# EAGLE design TemperatureSensor (EAGLE 7.1.0)
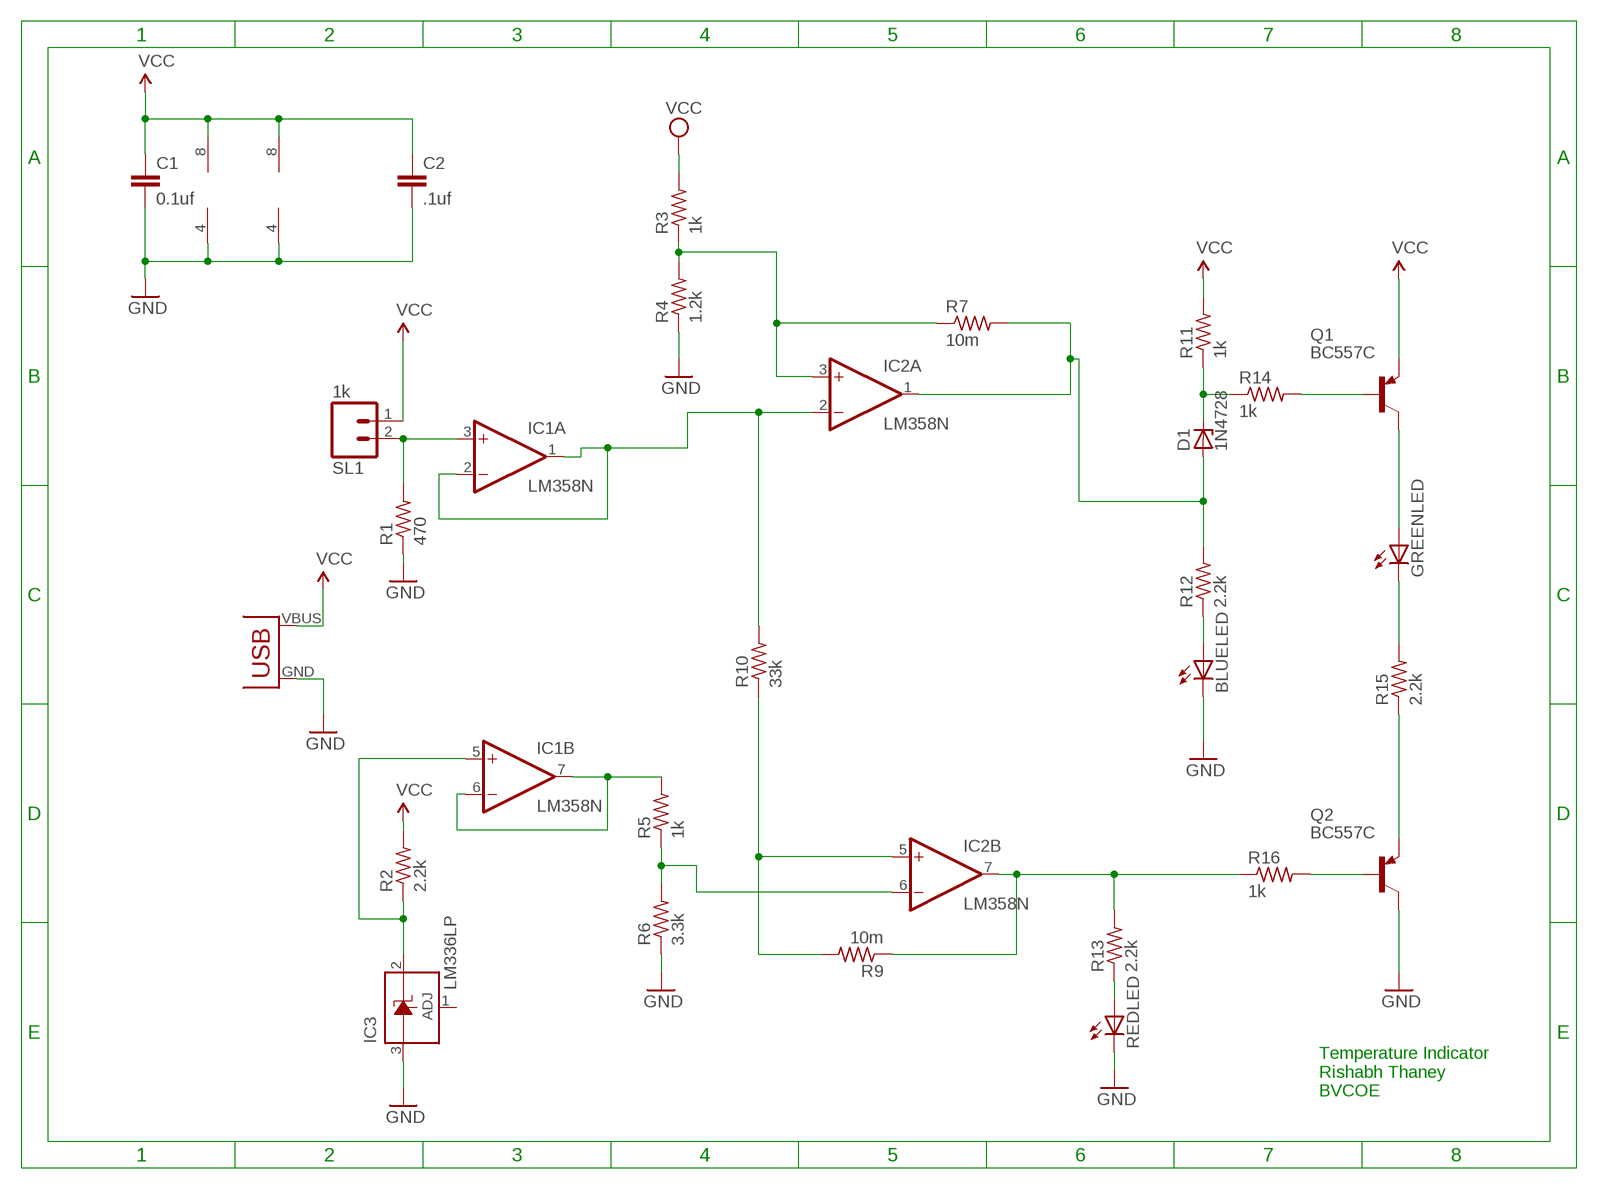
[diagram p0: schematic, sheet 1]

## Parts
BLUELED  LED5MM  [LED5MM]
C1  0.1uf  C-EU025-024X044  [C025-024X044]
C2  .1uf  C-EU025-024X044  [C025-024X044]
D1  1N4728  [DO41Z10]
GREENLED  LED5MM  [LED5MM]
IC1  LM358N  [DIL08]
IC2  LM358N  [DIL08]
IC3  LM336LP  [TO92]
Q1  BC557C  [TO92-EBC]
Q2  BC557C  [TO92-EBC]
R1  470  R-US_0204/7  [0204/7]
R2  2.2k  R-US_0204/7  [0204/7]
R3  1k  R-US_0204/7  [0204/7]
R4  1.2k  R-US_0204/7  [0204/7]
R5  1k  R-US_0204/7  [0204/7]
R6  3.3k  R-US_0204/7  [0204/7]
R7  10m  R-US_0204/7  [0204/7]
R9  10m  R-US_0204/7  [0204/7]
R10  33k  R-US_0204/7  [0204/7]
R11  1k  R-US_0204/7  [0204/7]
R12  2.2k  R-US_0204/7  [0204/7]
R13  2.2k  R-US_0204/7  [0204/7]
R14  1k  R-US_0204/7  [0204/7]
R15  2.2k  R-US_0204/7  [0204/7]
R16  1k  R-US_0204/7  [0204/7]
REDLED  LED5MM  [LED5MM]
SL1  1k  M02  [02P]
U$1  USB(POWER)  [USB(POWER)]

## Nets
GND: BLUELED.K(C) C1.2 C2.2 IC1.4(P:V-) IC2.4(P:V-) IC3.3(A) Q2.C R1.1 R4.1 R6.1 REDLED.K(C) U$1.GND
N$1: IC1.3(A:+IN) R1.2 SL1.2
N$2: R13.1 REDLED.A
N$3: IC2.3(A:+IN) R3.1 R4.2 R7.1
N$4: BLUELED.A R12.1
N$5: D1.C R11.1 R14.1
N$6: D1.A IC2.1(A:OUT) R7.2 R12.2
N$7: Q1.B R14.2
N$8: GREENLED.A Q1.C
N$9: GREENLED.K(C) R15.2
N$10: Q2.E R15.1
N$11: Q2.B R16.2
N$12: IC2.7(B:OUT) R9.1 R13.2 R16.1
N$15: IC1.6(B:-IN) IC1.7(B:OUT) R5.2
N$16: IC2.6(B:-IN) R5.1 R6.2
N$18: IC1.5(B:+IN) IC3.2(C) R2.1
N$19: IC1.1(A:OUT) IC1.2(A:-IN) IC2.2(A:-IN) R10.2
N$21: IC2.5(B:+IN) R9.2 R10.1
VCC: C1.1 C2.1 IC1.8(P:V+) IC2.8(P:V+) Q1.E R2.2 R3.2 R11.2 SL1.1 U$1.VBUS(VCC)
Unconnected: IC3.1(ADJ)

## Notes on the sheet
- Temperature Indicator
  Rishabh Thaney
  BVCOE

## Library data of the parts
BLUELED GREENLED REDLED = CEDT_JANUARY_2015_v7:LED
C1 C2 = rcl:C-EU: CAPACITOR, European symbol
D1 = diode:1N4728: Z DIODE 3.3 V, 1W, 5 percent
IC1 IC2 = CEDT_JANUARY_2015_v7:LM358: OP AMP also LM158; LM258; LM2904 Source: http://cache.national.com/ds/LM/LM158.pdf
IC3 = linear:LM336: 2.5-V INTEGRATED REFERENCE CIRCUITS LM236 Source: http://focus.ti.com/lit/ds/symlink/lm336-2.5.pdf
Q1 Q2 = transistor-pnp:BC557*: PNP Transistror
R1-R7 R9-R16 = rcl:R-US_: RESISTOR, American symbol
SL1 = CEDT_JANUARY_2015_v7:M02: AMP QUICK CONNECTOR
U$1 = CEDT_JANUARY_2015_v7:USB(POWER)

## Board
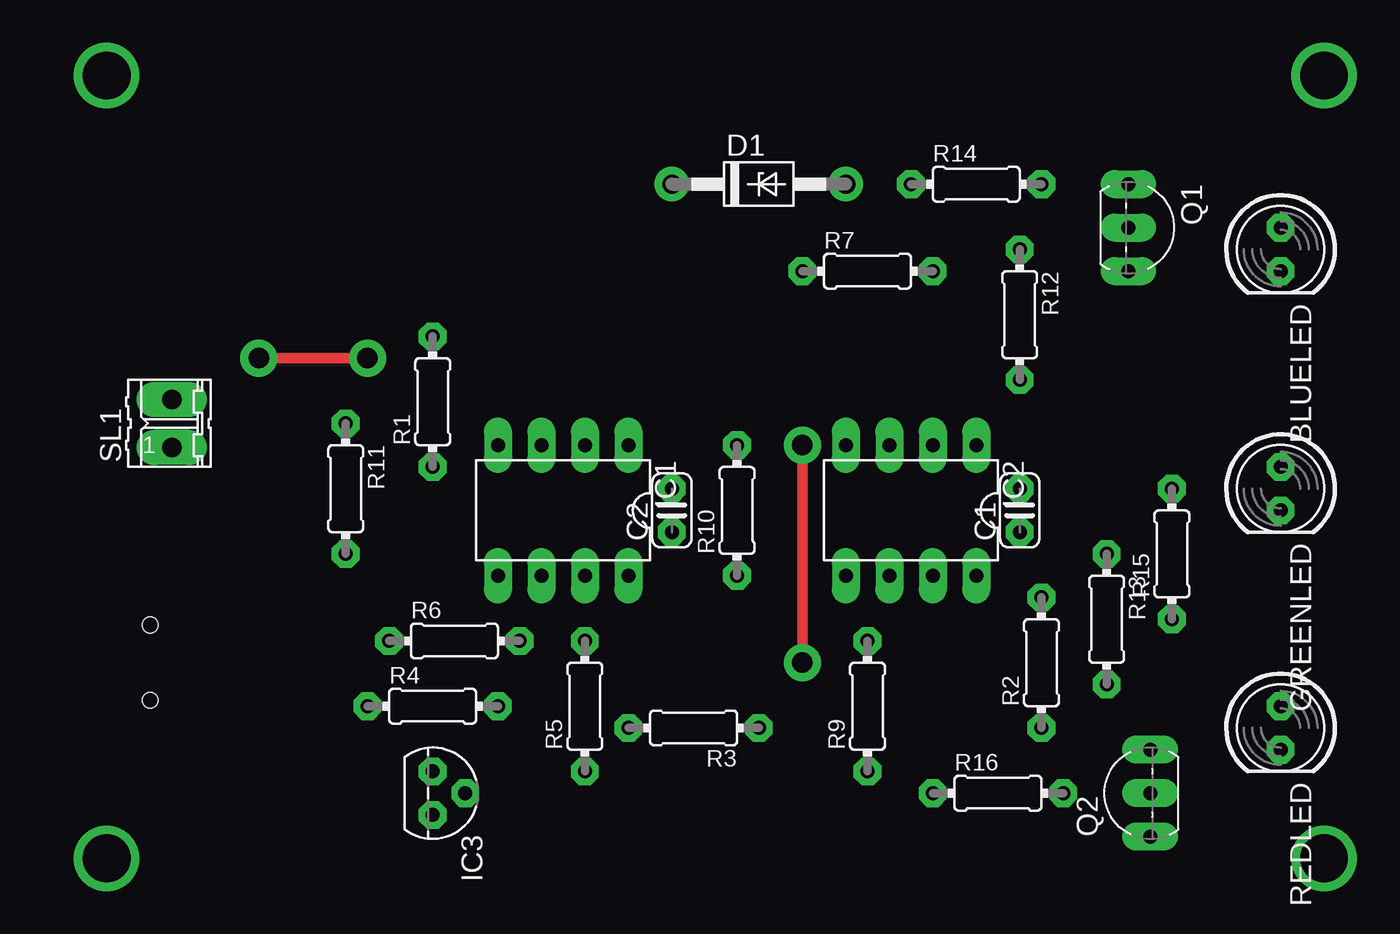
[diagram p1: board, top side]
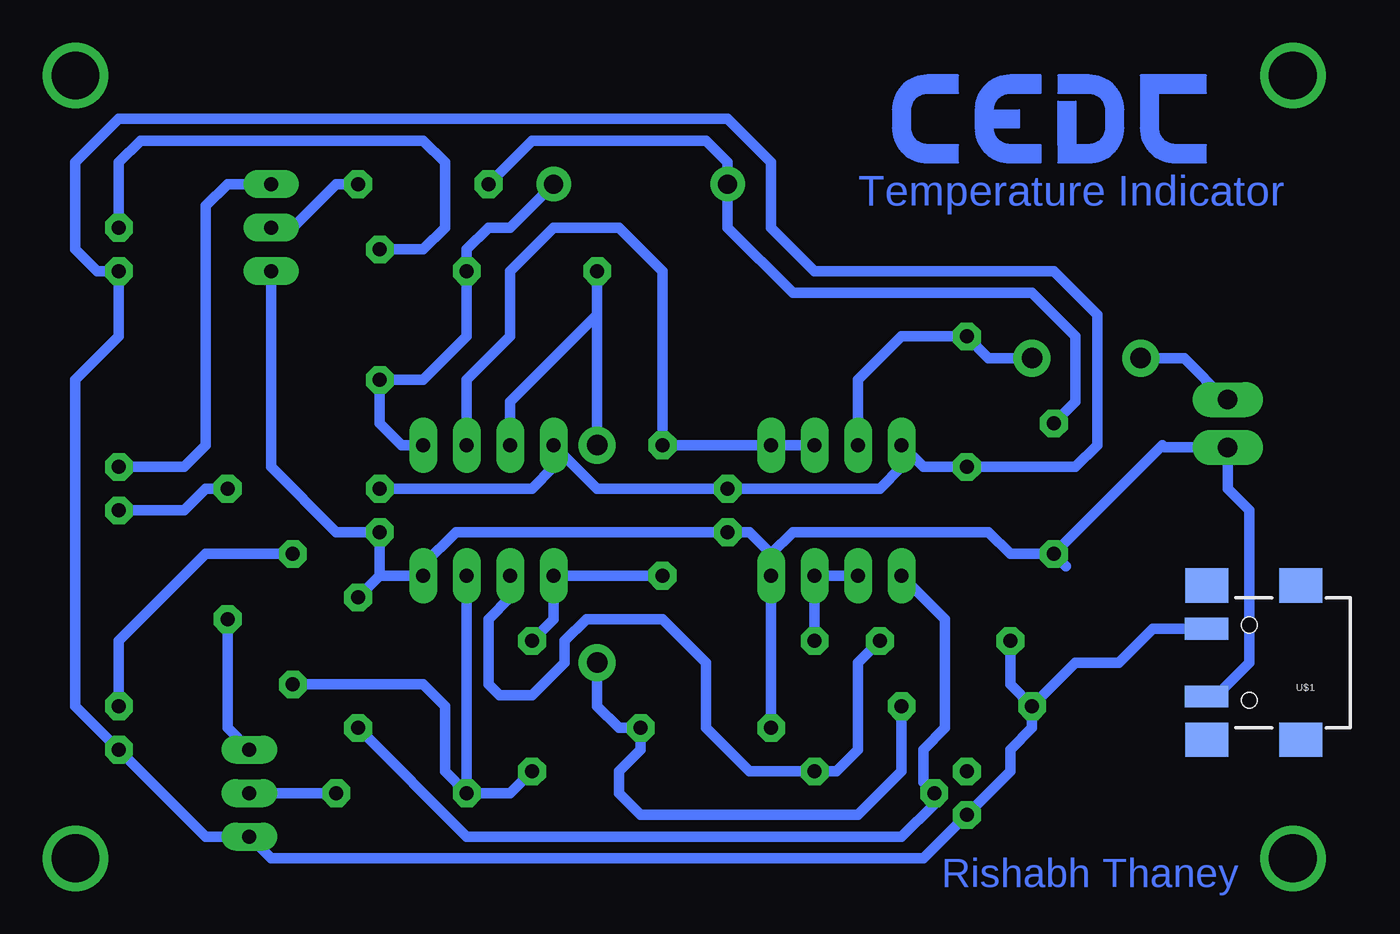
[diagram p2: board, bottom side, seen from below]

No outline drawn. Coordinates in mm, seen from the top.
Copper layers (1*16): Top 0.035mm / dielectric 1.5mm / Bottom 0.035mm
Design rules "default *": minimum track width 10mil, minimum drill 24mil, track to track 12mil, track to pad 12mil, pad to pad 8mil, via to via 8mil, smd to smd 8mil, copper to edge 40mil, drill to drill 8mil, minimum pad ring 16mil, minimum via ring 8mil, stop-mask expansion 4mil, vias tented up to drill 0mil, thermal gap 10mil

### Footprints (pad centres in the part's own frame; a part is rotated, then mirrored left to right if it is on the bottom)
LED5MM = drill 0.813 octagon: A -1.27,0; K 1.27,0
C025-024X044 = drill 0.813 octagon: 1 -1.27,0; 2 1.27,0
DO41Z10 = drill 1.118: A 5.08,0; C -5.08,0
DIL08 = drill 0.813 long: 1 -3.81,-3.81; 2 -1.27,-3.81; 3 1.27,-3.81; 4 3.81,-3.81; 5 3.81,3.81; 6 1.27,3.81; 7 -1.27,3.81; 8 -3.81,3.81
TO92 = drill 0.813 octagon: 1 -1.27,0; 2 0,1.905; 3 1.27,0
TO92-EBC = drill 0.813 long: B 0,-1.27; C -2.54,-1.27; E 2.54,-1.27
0204/7 = drill 0.813 octagon: 1 -3.81,0; 2 3.81,0
02P = drill 1.143 long: 1 -1.397,0; 2 1.397,0
USB(POWER) = smd 2.54 x 1.27: GND 2.5,-1.981; VBUS 2.5,1.981 | smd 2.5 x 2: GND@1 -3,-4.5; GND@2 -3,4.5; GND@3 2.5,4.5; GND@4 2.5,-4.5 | hole 0.9: 0,2.2; 0,-2.2

### Placement (x,y rotation side)
BLUELED  71.12,38.1 270 top
C1  55.88,22.86 90 top
C2  35.56,22.86 90 top
D1  40.64,41.91 0 top
GREENLED  71.12,24.13 270 top
IC1  29.21,22.86 180 top
IC2  49.53,22.86 180 top
IC3  21.59,6.35 270 top
Q1  63.5,39.37 270 top
Q2  62.23,6.35 90 top
R1  21.59,29.21 90 top
R2  57.15,13.97 90 top
R3  36.83,10.16 180 top
R4  21.59,11.43 0 top
R5  30.48,11.43 90 top
R6  22.86,15.24 0 top
R7  46.99,36.83 0 top
R9  46.99,11.43 90 top
R10  39.37,22.86 90 top
R11  16.51,24.13 270 top
R12  55.88,34.29 270 top
R13  60.96,16.51 270 top
R14  53.34,41.91 0 top
R15  64.77,20.32 90 top
R16  54.61,6.35 0 top
REDLED  71.12,10.16 270 top
SL1  6.35,27.94 90 top
U$1  5.08,13.97 180 bottom
U$2  [LOGO-CEDT-BOT-18MM]  7.62,43.18 0 top

### Tracks (layer width: path | path; a pad name or v marks a point on that pad's centre or on a via)
GND
  Bottom 0.61: R4.1 19.05,12.7 R6.1 | 25.4,27.94 IC1.4 | IC1.4 24.13,25.4 R1.1 15.24,25.4 13.97,26.67 13.97,34.29 16.51,36.83 30.48,36.83 33.02,39.37 33.02,43.18 35.56,45.72 71.12,45.72 73.66,43.18 73.66,38.1 72.39,36.83 BLUELED.K 71.12,33.02 73.66,30.48 73.66,11.43 REDLED.K 66.04,3.81 Q2.C 62.23,2.54 24.13,2.54 IC3.3 19.05,7.62 19.05,8.89 17.78,10.16 R4.1 | C1.2 46.99,24.13 45.72,25.4 IC2.4 43.18,24.13 C2.2 26.67,24.13 25.4,25.4 IC1.4 | U$1.GND 10.72,15.95 12.7,13.97 15.24,13.97 R4.1
N$1  (via drill 1.2 pad 1.93)
  Top 0.61: v17.78,31.75 v11.43,31.75
  Bottom 0.61: v17.78,31.75 20.32,31.75 R1.2 25.4,33.02 27.94,30.48 IC1.3 | SL1.2 6.48,29.34 8.89,31.75 v11.43,31.75
N$2
  Bottom 0.61: REDLED.A 71.12,15.24 66.04,20.32 R13.1
N$3  (via drill 1.2 pad 1.93)
  Top 0.61: v43.18,13.97 v43.18,26.67
  Bottom 0.61: R4.2 25.4,7.62 27.94,5.08 40.64,5.08 41.91,6.35 41.91,7.62 40.64,8.89 R3.1 41.91,10.16 43.18,11.43 v43.18,13.97 | R7.1 43.18,34.29 | 43.18,34.29 48.26,29.21 IC2.3 | v43.18,26.67 43.18,34.29
N$4
  Bottom 0.61: BLUELED.A 71.12,43.18 69.85,44.45 53.34,44.45 52.07,43.18 52.07,39.37 53.34,38.1 R12.1
N$5
  Bottom 0.61: R14.1 46.99,44.45 36.83,44.45 35.56,43.18 D1.C 35.56,39.37 31.75,35.56 17.78,35.56 15.24,33.02 15.24,29.21 R11.1
N$6
  Bottom 0.61: IC2.1 54.61,26.67 55.88,27.94 R12.2 53.34,30.48 50.8,33.02 R7.2 50.8,38.1 49.53,39.37 48.26,39.37 D1.A
N$7
  Bottom 0.61: R14.2 58.42,41.91 60.96,39.37 Q1.B
N$8
  Bottom 0.61: GREENLED.A 67.31,25.4 66.04,26.67 66.04,40.64 64.77,41.91 Q1.C
N$9
  Bottom 0.61: R15.2 66.04,24.13 67.31,22.86 GREENLED.K
N$10
  Bottom 0.61: R15.1 64.77,10.16 Q2.E
N$11
  Bottom 0.61: R16.2 Q2.B
N$12
  Bottom 0.61: IC2.7 R16.1 | R9.1 48.26,6.35 R16.1 | R16.1 52.07,7.62 52.07,11.43 53.34,12.7 R13.2
N$13  (via drill 2.79 pad 3.81)
  other vias: 2.54,48.26
N$14  (via drill 2.79 pad 3.81)
  other vias: 2.54,2.54
N$15
  Bottom 0.61: IC1.6 IC1.7 R5.2
N$16
  Bottom 0.61: IC2.6 48.26,17.78 49.53,16.51 49.53,12.7 48.9,12.06 46.99,12.06 45.09,13.97 45.09,15.24 43.81,16.51 39.37,16.51 36.83,13.97 36.83,10.16 34.29,7.62 R5.1 29.21,7.62 27.94,8.89 27.94,13.97 R6.2
N$17  (via drill 2.79 pad 3.81)
  other vias: 73.66,2.54
N$18
  Bottom 0.61: IC1.5 22.86,16.51 22.86,10.16 24.13,8.89 24.13,6.99 IC3.2 23.5,5.71 25.4,3.81 50.8,3.81 R2.1
N$19
  Bottom 0.61: IC1.2 IC1.1 | IC2.2 50.8,30.48 48.26,33.02 48.26,36.83 45.72,39.37 41.91,39.37 39.37,36.83 R10.2 IC1.1 | IC1.1 33.02,27.94
N$20  (via drill 2.79 pad 3.81)
  other vias: 73.66,48.26
N$21
  Bottom 0.61: R9.2 45.72,16.51 IC2.5 R10.1
VCC
  Bottom 0.61: 33.02,20.32 31.75,21.59 20.32,21.59 19.05,20.32 R11.2 | 33.02,20.32 IC1.8 R3.2 | 33.02,20.32 34.29,21.59 C2.1 51.44,21.59 53.34,19.68 IC2.8 55.88,19.05 | 55.88,19.05 R2.2 | Q1.E 62.23,25.4 58.42,21.59 C1.1 55.88,19.05 | R11.2 10.16,26.67 10.03,26.54 SL1.1 6.35,24.13 5.08,22.86 5.08,13.97 7.06,11.99 U$1.VBUS | 15.8,19.61 R11.2

### Text on the board
Bottom: Temperature Indicator | Rishabh Thaney